# EAGLE schematic garbageSensor (EAGLE 6.4)
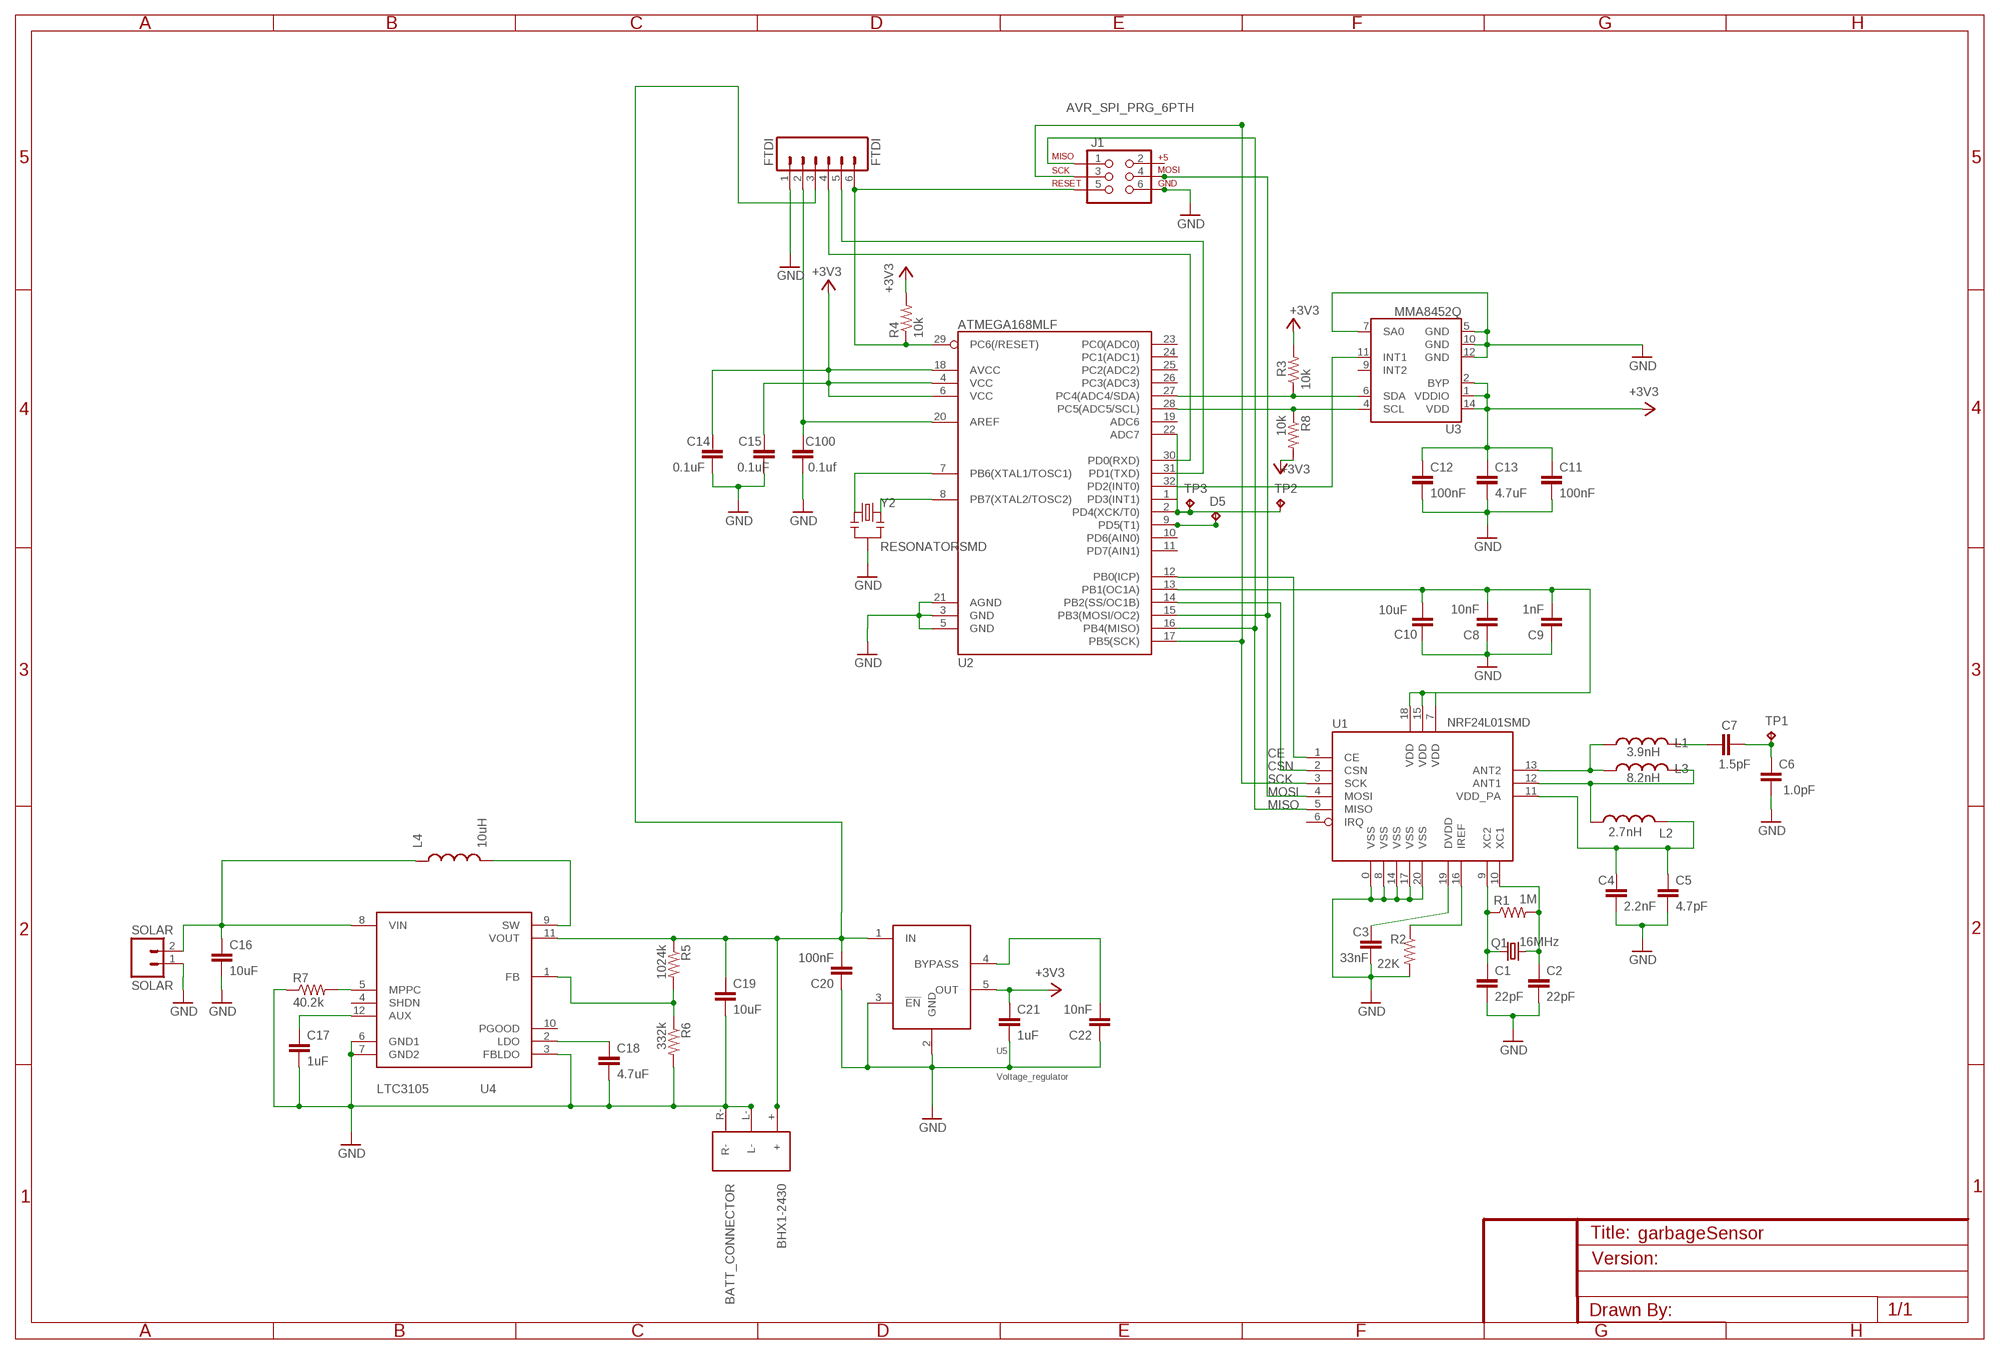
[diagram p0: schematic, sheet 1]

## Parts
B1  BATT_CONNECTOR  BHX1-2325  [BHX1-2325]
C1  22pF  CAP0603  [0603]
C2  22pF  CAP0603  [0603]
C3  33nF  CAP0603  [0603]
C4  2.2nF  CAP0402  [C0402]
C5  4.7pF  CAP0402  [C0402]
C6  1.0pF  CAP0402  [C0402]
C7  1.5pF  CAP0402  [C0402]
C8  10nF  CAP0603  [0603]
C9  1nF  CAP0603  [0603]
C10  10uF  C-EUC0603K  [C0603K]
C11  100nF  C-EUC0603K  [C0603K]
C12  100nF  C-EUC0603K  [C0603K]
C13  4.7uF  C-EUC0603K  [C0603K]
C14  0.1uF  C-EUC0603K  [C0603K]
C15  0.1uF  C-EUC0603K  [C0603K]
C16  10uF  C-EUC0603K  [C0603K]
C17  1uF  C-EUC0603K  [C0603K]
C18  4.7uF  C-EUC0603K  [C0603K]
C19  10uF  C-EUC0603K  [C0603K]
C20  100nF  C-EUC0603K  [C0603K]
C21  1uF  C-EUC0603K  [C0603K]
C22  10nF  CAP0603  [0603]
C100  0.1uf  CAP0603-CAP  [0603-CAP]
D5  TPTP06R  [TP06R]
FTDI  FTDI  M06SIP  [1X06]
J1  AVR_SPI_PRG_6PTH  [2X3]
L1  3.9nH  INDUCTOR0402  [C0402]
L2  2.7nH  INDUCTOR0402  [C0402]
L3  8.2nH  INDUCTOR0402  [C0402]
L4  10uH  LQH2  [0806]
Q1  16MHz  CRYSTAL5X3  [CRYSTAL-SMD-5X3]
R1  1M  RESISTOR0603  [0603]
R2  22K  RESISTOR0603  [0603]
R3  10k  R-US_R0603  [R0603]
R4  10k  R-US_R0603  [R0603]
R5  1024k  R-US_R0603  [R0603]
R6  332k  R-US_R0603  [R0603]
R7  40.2k  R-US_R0603  [R0603]
R8  10k  R-US_R0603  [R0603]
SOLAR  SOLAR  M02LOCK  [1X02_LOCK]
TP1  TPB2,54  [B2,54]
TP2  TPTP06R  [TP06R]
TP3  TPTP06R  [TP06R]
U1  NRF24L01SMD  [QFN20]
U2  ATMEGA168MLF  [MLF32]
U3  MMA8452Q  [QFN-16_0.5MM]
U4  CHARGER  LTC3105  [MSOP-12]
U5  Voltage_regulator  TPS79133DBVR_(LDO_3_3V_TI)  [TPS79133DBVR_(LDO_3_3V_TI)]
Y2  RESONATORSMD  [RESONATOR-SMD]

## Nets
+3V3: C11.1 C12.1 C13.1 C14.2 C15.2 C21.1 R3.2 R4.2 R8.2 U2.4(VCC) U2.6(VCC) U2.18(AVCC) U3.1(VDDIO) U3.2(BYP) U3.14(VDD) U5.5(OUT)
ACCELERO_INTERRUPT: U2.32(PD2(INT0)) U3.11(INT1)
ANT: C6.2 C7.2 TP1.TP
ANTENNA1: L1.1 L3.1 U1.13(ANT2)
ANTENNA2: L2.1 L3.2 U1.12(ANT1)
ANTENNA3: C4.1 C5.1 L2.2 U1.11(VDD_PA)
AREF: C100.1 FTDI.2 U2.20(AREF)
AUX: C17.1 U4.12(AUX)
CE: U1.1(CE) U2.12(PB0(ICP))
CSN: U1.2(CSN) U2.14(PB2(SS/OC1B))
FB: R5.2 R6.1 U4.1(FB)
GND: B1.L- B1.R- C1.2 C2.2 C3.2 C4.2 C5.2 C6.1 C8.1 C9.1 C10.2 C11.2 C12.2 C13.2 C14.1 C15.1 C16.2 C17.2 C18.2 C19.2 C20.1 C21.2 C22.1 C100.2 FTDI.1 J1.6 R2.2 R6.2 R7.1 SOLAR.1 U1.0(VSS) U1.8(VSS) U1.14(VSS) U1.17(VSS) U1.20(VSS) U2.3(GND) U2.5(GND) U2.21(AGND) U3.5(GND) U3.7(SA0) U3.10(GND) U3.12(GND) U4.3(FBLDO) U4.6(GND1) U4.7(GND2) U5.2(GND) U5.3(!EN!) Y2.2
LDO: C18.1 U4.2(LDO)
MISO: J1.1 U1.5(MISO) U2.16(PB4(MISO))
MOSI: J1.4 U1.4(MOSI) U2.15(PB3(MOSI/OC2))
MPPC: R7.2 U4.5(MPPC)
N$1: C1.1 Q1.1 R1.1 U1.9(XC2)
N$2: C2.1 Q1.3 R1.2 U1.10(XC1)
N$3: D5.TP U2.9(PD5(T1))
N$4: R2.1 U1.16(IREF)
N$5: C3.1 U1.19(DVDD)
N$6: TP3.TP U2.2(PD4(XCK/T0))
N$7: TP2.TP U2.22(ADC7)
N$9: C7.1 L1.2
N$10: C22.2 U5.4(BYPASS)
N$11: L4.P$2 U4.9(SW)
RESET: FTDI.6 J1.5 R4.1 U2.29(PC6(/RESET))
RX: FTDI.4 U2.30(PD0(RXD))
SCK: J1.3 U1.3(SCK) U2.17(PB5(SCK))
SCL: R8.1 U2.28(PC5(ADC5/SCL)) U3.4(SCL)
SDA: R3.1 U2.27(PC4(ADC4/SDA)) U3.6(SDA)
SOLAR: C16.1 L4.P$1 SOLAR.2 U4.8(VIN)
TX: FTDI.5 U2.31(PD1(TXD))
VBATT: B1.+ C19.1 C20.2 FTDI.3 R5.1 U4.11(VOUT) U5.1(IN)
WIRELESS_POWER_LINE: C8.2 C9.2 C10.1 U1.7(VDD) U1.15(VDD) U1.18(VDD) U2.13(PB1(OC1A))
XTAL1: U2.7(PB6(XTAL1/TOSC1)) Y2.1
XTAL2: U2.8(PB7(XTAL2/TOSC2)) Y2.3
Unconnected: J1.2 U1.6(IRQ) U2.1(PD3(INT1)) U2.10(PD6(AIN0)) U2.11(PD7(AIN1)) U2.19(ADC6) U2.23(PC0(ADC0)) U2.24(PC1(ADC1)) U2.25(PC2(ADC2)) U2.26(PC3(ADC3)) U3.9(INT2) U4.4(SHDN) U4.10(PGOOD)

## Library data of the parts
B1 = CONNECTORS:BHX1-2325: coin cell battery holder. For 24mm cells with through hole integration. Has glider for positive and metal for ground; MOUNTING: Through hole; SIZE: 24.5mm
C1-C9 C22 = SparkFun:CAP: Capacitor Standard 0603 ceramic capacitor, and 0.1" leaded capacitor.
C10-C21 = resistor:C-EU: CAPACITOR, European symbol
C100 = SparkFun-Capacitors:CAP: Capacitor Standard 0603 ceramic capacitor, and 0.1" leaded capacitor.
D5 TP1-TP3 = testpad:TP: Test pad
FTDI = SparkFun-Connectors:M06: Header 6 Standard 6-pin 0.1" header. Use with straight break away headers (SKU : PRT-00116), right angle break away headers (PRT-00553), swiss pins (PRT-00743), machine pins (PRT-00117), and female headers (PRT-00115). Molex polarized connector foot print use with SKU : PRT-08094 with associated crimp pins and housings. NOTES ON THE VARIANTS LOCK and LOCK_LONGPADS... This footprint was designed to help hold the alignment of a through-hole component (i.e. 6-pin header) while soldering it into place. You may notice that each hole has been shifted either up or down by 0.005 of an inch from it's more standard position (which is a perfectly straight line). This slight alteration caused the pins (the squares in the middle) to touch the edges of the holes. Because they are alternating, it causes a "brace" to hold the component in place. 0.005 has proven to be the perfect amount of "off-center" position when using our standard breakaway headers. Although looks a little odd when you look at the bare footprint, once you have a header in there, the alteration is very hard to notice. Also, if you push a header all the way into place, it is covered up entirely on the bottom side. This idea of altering the position of holes to aid alignment will be further integrated into the Sparkfun Library for other footprints. It can help hold any component with 3 or more connection pins.
J1 = SparkFun-Connectors:AVR_SPI_PRG_6: AVR ISP 6 Pin This is the reduced ISP connector for AVR programming. Common on Arduino. This footprint will take up less PCB space and can be used with a 10-pin to 6-pin adapter such as SKU: BOB-08508
L1-L3 = SparkFun:INDUCTOR: Inductors Basic Inductor/Choke - 0603 and 1206. Footprints are not proven and vary greatly between part numbers.
L4 = INDUCTORS:LQH2
Q1 = SparkFun:CRYSTAL: Crystals Various standard crystals. Proven footprints. Spark Fun Electronics SKU : COM-00534
R1 R2 = SparkFun:RESISTOR: Resistor Basic schematic elements and footprints for 0603, 1206, and PTH 1/10th watt (small) resistors.
R3-R8 = resistor:R-US_: RESISTOR, American symbol
SOLAR = SparkFun-Connectors:M02: Header 2 Standard 2-pin 0.1" header. Use with straight break away headers (SKU : PRT-00116), right angle break away headers (PRT-00553), swiss pins (PRT-00743), machine pins (PRT-00117), and female headers (PRT-00115). Molex polarized connector foot print use with SKU : PRT-08233 with associated crimp pins and housings.
U1 = SparkFun:NRF24L01: 2.4GHz Low Power Transceiver This is the very popular, low cost, very low power RF transceiver from Nordic Semiconductor. Simple SPI interface. SKU: COM-00690
U2 = SparkFun-DigitalIC:ATMEGA168: Atmel 32-pin 8-bit micro, 16k flash.
U3 = SparkFun-Sensors:MMA8452Q: MMA8452Q 3-Axis, 12/8-bit Digital Accelerometer Supply Voltage: 1.6-3.6V Range: +/- 2g, 4g, 8g Interface: I2C, 12-bit and 8-bit ODR: 1.56 Hz - 800 Hz Package: QFN-16 http://cache.freescale.com/files/sensors/doc/data_sheet/MMA8452Q.pdf
U4 = DC-DC_CONVERTERS:LTC3105
U5 = REGULATORS:TPS79133DBVR_(LDO_3_3V_TI)
Y2 = SparkFun-FreqCtrl:RESONATOR: Resonator Small SMD resonator. This is the itty bitty 10/20MHz resonators with built in caps. CSTCE10M0G55 and CSTCE20M0V53. Footprint has been reviewed closely but hasn't been tested yet.